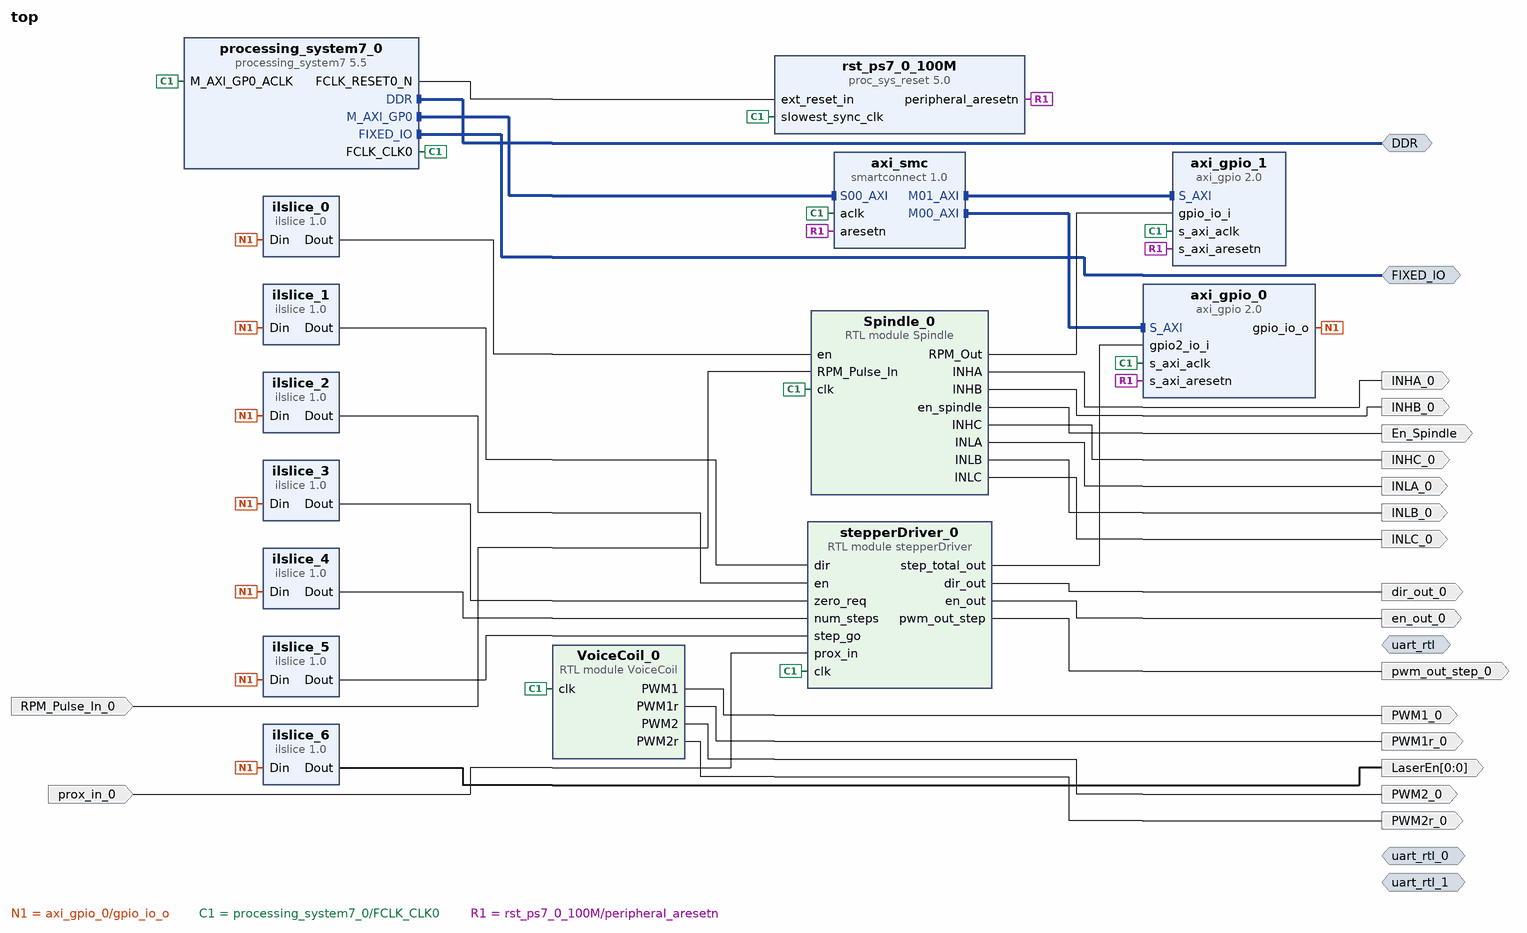
[diagram p0: block diagram of the top level]
# Vivado block design top, xc7z020clg400-1, Vivado 2025.1
create_bd_design top

create_bd_intf_port -mode Master -vlnv xilinx.com:interface:ddrx_rtl:1.0 DDR
create_bd_intf_port -mode Master -vlnv xilinx.com:display_processing_system7:fixedio_rtl:1.0 FIXED_IO
create_bd_intf_port -mode Master -vlnv xilinx.com:interface:uart_rtl:1.0 uart_rtl
create_bd_intf_port -mode Master -vlnv xilinx.com:interface:uart_rtl:1.0 uart_rtl_0
create_bd_intf_port -mode Master -vlnv xilinx.com:interface:uart_rtl:1.0 uart_rtl_1
create_bd_port -dir O En_Spindle
create_bd_port -dir O INHA_0
create_bd_port -dir O INLA_0
create_bd_port -dir O INHB_0
create_bd_port -dir O INLB_0
create_bd_port -dir O INHC_0
create_bd_port -dir O INLC_0
create_bd_port -dir I prox_in_0
create_bd_port -dir O dir_out_0
create_bd_port -dir O pwm_out_step_0
create_bd_port -dir O en_out_0
create_bd_port -dir O -from 0 -to 0 -type data LaserEn
create_bd_port -dir I RPM_Pulse_In_0
create_bd_port -dir O PWM1_0
create_bd_port -dir O PWM1r_0
create_bd_port -dir O PWM2_0
create_bd_port -dir O PWM2r_0

create_bd_cell -type ip -vlnv xilinx.com:ip:processing_system7:5.5 processing_system7_0
set_property -dict [list \
  CONFIG.PCW_APU_PERIPHERAL_FREQMHZ 650 \
  CONFIG.PCW_CRYSTAL_PERIPHERAL_FREQMHZ 50 \
  CONFIG.PCW_ENET0_ENET0_IO {MIO 16 .. 27} \
  CONFIG.PCW_ENET0_GRP_MDIO_ENABLE 1 \
  CONFIG.PCW_ENET0_GRP_MDIO_IO {MIO 52 .. 53} \
  CONFIG.PCW_ENET0_PERIPHERAL_ENABLE 1 \
  CONFIG.PCW_ENET0_RESET_ENABLE 1 \
  CONFIG.PCW_ENET0_RESET_IO {MIO 9} \
  CONFIG.PCW_ENET_RESET_ENABLE 1 \
  CONFIG.PCW_ENET_RESET_SELECT {Share reset pin} \
  CONFIG.PCW_FPGA0_PERIPHERAL_FREQMHZ 125 \
  CONFIG.PCW_FPGA1_PERIPHERAL_FREQMHZ 50 \
  CONFIG.PCW_GPIO_EMIO_GPIO_ENABLE 1 \
  CONFIG.PCW_GPIO_EMIO_GPIO_IO 64 \
  CONFIG.PCW_GPIO_MIO_GPIO_ENABLE 1 \
  CONFIG.PCW_GPIO_MIO_GPIO_IO MIO \
  CONFIG.PCW_I2C_RESET_ENABLE 1 \
  CONFIG.PCW_IRQ_F2P_INTR 1 \
  CONFIG.PCW_M_AXI_GP0_FREQMHZ 10 \
  CONFIG.PCW_PERIPHERAL_BOARD_PRESET part0 \
  CONFIG.PCW_PRESET_BANK1_VOLTAGE {LVCMOS 3.3V} \
  CONFIG.PCW_QSPI_GRP_FBCLK_ENABLE 1 \
  CONFIG.PCW_QSPI_GRP_FBCLK_IO {MIO 8} \
  CONFIG.PCW_QSPI_GRP_SINGLE_SS_ENABLE 1 \
  CONFIG.PCW_QSPI_GRP_SINGLE_SS_IO {MIO 1 .. 6} \
  CONFIG.PCW_QSPI_PERIPHERAL_ENABLE 1 \
  CONFIG.PCW_QSPI_QSPI_IO {MIO 1 .. 6} \
  CONFIG.PCW_SD0_GRP_CD_ENABLE 1 \
  CONFIG.PCW_SD0_GRP_CD_IO {MIO 47} \
  CONFIG.PCW_SD0_GRP_WP_ENABLE 0 \
  CONFIG.PCW_SD0_PERIPHERAL_ENABLE 1 \
  CONFIG.PCW_SD0_SD0_IO {MIO 40 .. 45} \
  CONFIG.PCW_SDIO_PERIPHERAL_FREQMHZ 50 \
  CONFIG.PCW_SINGLE_QSPI_DATA_MODE x4 \
  CONFIG.PCW_UART0_PERIPHERAL_ENABLE 1 \
  CONFIG.PCW_UART0_UART0_IO {MIO 14 .. 15} \
  CONFIG.PCW_UART1_PERIPHERAL_ENABLE 0 \
  CONFIG.PCW_UART_PERIPHERAL_FREQMHZ 100 \
  CONFIG.PCW_UIPARAM_DDR_BUS_WIDTH {16 Bit} \
  CONFIG.PCW_UIPARAM_DDR_FREQ_MHZ 525 \
  CONFIG.PCW_UIPARAM_DDR_PARTNO {MT41J256M16 RE-125} \
  CONFIG.PCW_USB0_PERIPHERAL_ENABLE 1 \
  CONFIG.PCW_USB0_RESET_ENABLE 1 \
  CONFIG.PCW_USB0_RESET_IO {MIO 46} \
  CONFIG.PCW_USB0_USB0_IO {MIO 28 .. 39} \
  CONFIG.PCW_USB_RESET_ENABLE 1 \
  CONFIG.PCW_USB_RESET_SELECT {Share reset pin} \
  CONFIG.PCW_USE_FABRIC_INTERRUPT 1 \
  CONFIG.preset None \
] [get_bd_cells processing_system7_0]
# 507 more settings of processing_system7_0 are not shown: defaults, MIO pin electricals, DDR timing, and values the tool derives
create_bd_cell -type module -reference Spindle Spindle_0
create_bd_cell -type module -reference stepperDriver stepperDriver_0
create_bd_cell -type ip -vlnv xilinx.com:ip:axi_gpio:2.0 axi_gpio_0
set_property -dict [list \
  CONFIG.C_ALL_INPUTS_2 1 \
  CONFIG.C_ALL_OUTPUTS 1 \
  CONFIG.C_GPIO_WIDTH 32 \
  CONFIG.C_IS_DUAL 1 \
] [get_bd_cells axi_gpio_0]
create_bd_cell -type ip -vlnv xilinx.com:ip:proc_sys_reset:5.0 rst_ps7_0_100M
create_bd_cell -type ip -vlnv xilinx.com:ip:smartconnect:1.0 axi_smc
set_property -dict {CONFIG.NUM_MI 3 CONFIG.NUM_SI 1} [get_bd_cells axi_smc]
create_bd_cell -type inline_hdl -vlnv xilinx.com:inline_hdl:ilslice:1.0 ilslice_0
create_bd_cell -type inline_hdl -vlnv xilinx.com:inline_hdl:ilslice:1.0 ilslice_1
set_property -dict {CONFIG.DIN_FROM 1 CONFIG.DIN_TO 1} [get_bd_cells ilslice_1]
create_bd_cell -type inline_hdl -vlnv xilinx.com:inline_hdl:ilslice:1.0 ilslice_2
set_property -dict {CONFIG.DIN_FROM 2 CONFIG.DIN_TO 2} [get_bd_cells ilslice_2]
create_bd_cell -type inline_hdl -vlnv xilinx.com:inline_hdl:ilslice:1.0 ilslice_3
set_property -dict {CONFIG.DIN_FROM 3 CONFIG.DIN_TO 3} [get_bd_cells ilslice_3]
create_bd_cell -type inline_hdl -vlnv xilinx.com:inline_hdl:ilslice:1.0 ilslice_4
set_property -dict {CONFIG.DIN_FROM 24 CONFIG.DIN_TO 4} [get_bd_cells ilslice_4]
create_bd_cell -type inline_hdl -vlnv xilinx.com:inline_hdl:ilslice:1.0 ilslice_5
set_property -dict {CONFIG.DIN_FROM 25 CONFIG.DIN_TO 25} [get_bd_cells ilslice_5]
create_bd_cell -type inline_hdl -vlnv xilinx.com:inline_hdl:ilslice:1.0 ilslice_6
set_property -dict {CONFIG.DIN_FROM 26 CONFIG.DIN_TO 26} [get_bd_cells ilslice_6]
create_bd_cell -type ip -vlnv xilinx.com:ip:axi_gpio:2.0 axi_gpio_1
set_property -dict {CONFIG.C_ALL_INPUTS 1 CONFIG.C_GPIO_WIDTH 16} [get_bd_cells axi_gpio_1]
create_bd_cell -type module -reference VoiceCoil VoiceCoil_0

# ---- connections ----

connect_bd_intf_net [get_bd_intf_pins axi_smc/M00_AXI] [get_bd_intf_pins axi_gpio_0/S_AXI]
connect_bd_intf_net [get_bd_intf_pins axi_smc/M01_AXI] [get_bd_intf_pins axi_gpio_1/S_AXI]
connect_bd_intf_net [get_bd_intf_ports DDR] [get_bd_intf_pins processing_system7_0/DDR]
connect_bd_intf_net [get_bd_intf_ports FIXED_IO] [get_bd_intf_pins processing_system7_0/FIXED_IO]
connect_bd_intf_net [get_bd_intf_pins processing_system7_0/M_AXI_GP0] [get_bd_intf_pins axi_smc/S00_AXI]
connect_bd_net -net RPM_Pulse_In_0_1 [get_bd_ports RPM_Pulse_In_0] [get_bd_pins Spindle_0/RPM_Pulse_In]
connect_bd_net [get_bd_pins Spindle_0/INHA] [get_bd_ports INHA_0]
connect_bd_net [get_bd_pins Spindle_0/INHB] [get_bd_ports INHB_0]
connect_bd_net [get_bd_pins Spindle_0/INHC] [get_bd_ports INHC_0]
connect_bd_net [get_bd_pins Spindle_0/INLA] [get_bd_ports INLA_0]
connect_bd_net [get_bd_pins Spindle_0/INLB] [get_bd_ports INLB_0]
connect_bd_net [get_bd_pins Spindle_0/INLC] [get_bd_ports INLC_0]
connect_bd_net [get_bd_pins Spindle_0/RPM_Out] [get_bd_pins axi_gpio_1/gpio_io_i]
connect_bd_net [get_bd_pins Spindle_0/en_spindle] [get_bd_ports En_Spindle]
connect_bd_net [get_bd_pins VoiceCoil_0/PWM1] [get_bd_ports PWM1_0]
connect_bd_net [get_bd_pins VoiceCoil_0/PWM1r] [get_bd_ports PWM1r_0]
connect_bd_net [get_bd_pins VoiceCoil_0/PWM2] [get_bd_ports PWM2_0]
connect_bd_net [get_bd_pins VoiceCoil_0/PWM2r] [get_bd_ports PWM2r_0]
connect_bd_net [get_bd_pins axi_gpio_0/gpio_io_o] \
  [get_bd_pins ilslice_0/Din] [get_bd_pins ilslice_1/Din] [get_bd_pins ilslice_2/Din] [get_bd_pins ilslice_3/Din] \
  [get_bd_pins ilslice_4/Din] [get_bd_pins ilslice_5/Din] [get_bd_pins ilslice_6/Din]
connect_bd_net [get_bd_pins ilslice_0/Dout] [get_bd_pins Spindle_0/en]
connect_bd_net [get_bd_pins ilslice_1/Dout] [get_bd_pins stepperDriver_0/dir]
connect_bd_net [get_bd_pins ilslice_2/Dout] [get_bd_pins stepperDriver_0/en]
connect_bd_net [get_bd_pins ilslice_3/Dout] [get_bd_pins stepperDriver_0/zero_req]
connect_bd_net [get_bd_pins ilslice_4/Dout] [get_bd_pins stepperDriver_0/num_steps]
connect_bd_net [get_bd_pins ilslice_5/Dout] [get_bd_pins stepperDriver_0/step_go]
connect_bd_net [get_bd_pins ilslice_6/Dout] [get_bd_ports LaserEn]
connect_bd_net [get_bd_pins processing_system7_0/FCLK_CLK0] \
  [get_bd_pins axi_gpio_0/s_axi_aclk] [get_bd_pins axi_smc/aclk] [get_bd_pins processing_system7_0/M_AXI_GP0_ACLK] \
  [get_bd_pins rst_ps7_0_100M/slowest_sync_clk] [get_bd_pins stepperDriver_0/clk] [get_bd_pins axi_gpio_1/s_axi_aclk] \
  [get_bd_pins VoiceCoil_0/clk] [get_bd_pins Spindle_0/clk]
connect_bd_net [get_bd_pins processing_system7_0/FCLK_RESET0_N] [get_bd_pins rst_ps7_0_100M/ext_reset_in]
connect_bd_net -net prox_in_0_1 [get_bd_ports prox_in_0] [get_bd_pins stepperDriver_0/prox_in]
connect_bd_net [get_bd_pins rst_ps7_0_100M/peripheral_aresetn] \
  [get_bd_pins axi_gpio_0/s_axi_aresetn] [get_bd_pins axi_smc/aresetn] [get_bd_pins axi_gpio_1/s_axi_aresetn]
connect_bd_net [get_bd_pins stepperDriver_0/dir_out] [get_bd_ports dir_out_0]
connect_bd_net [get_bd_pins stepperDriver_0/en_out] [get_bd_ports en_out_0]
connect_bd_net [get_bd_pins stepperDriver_0/pwm_out_step] [get_bd_ports pwm_out_step_0]
connect_bd_net [get_bd_pins stepperDriver_0/step_total_out] [get_bd_pins axi_gpio_0/gpio2_io_i]

# ---- address map ----
assign_bd_address -offset 0x41200000 -range 64K -target_address_space [get_bd_addr_spaces processing_system7_0/Data] [get_bd_addr_segs axi_gpio_0/S_AXI/Reg]
assign_bd_address -offset 0x41210000 -range 64K -target_address_space [get_bd_addr_spaces processing_system7_0/Data] [get_bd_addr_segs axi_gpio_1/S_AXI/Reg]

validate_bd_design
save_bd_design
